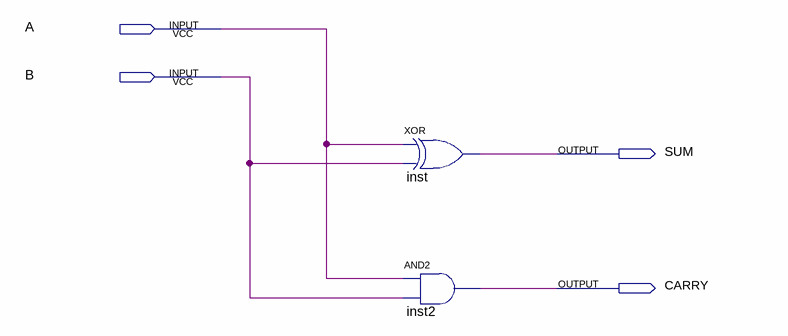
[diagram p0: schematic sheet]
// Quartus schematic HALF_ADDER.bdf as structural Verilog: 2 symbols, 4 pins
module HALF_ADDER (
  input  A,
  input  B,
  output SUM,
  output CARRY
);

  xor inst (SUM, A, B);
  and inst2 (CARRY, A, B);
endmodule
